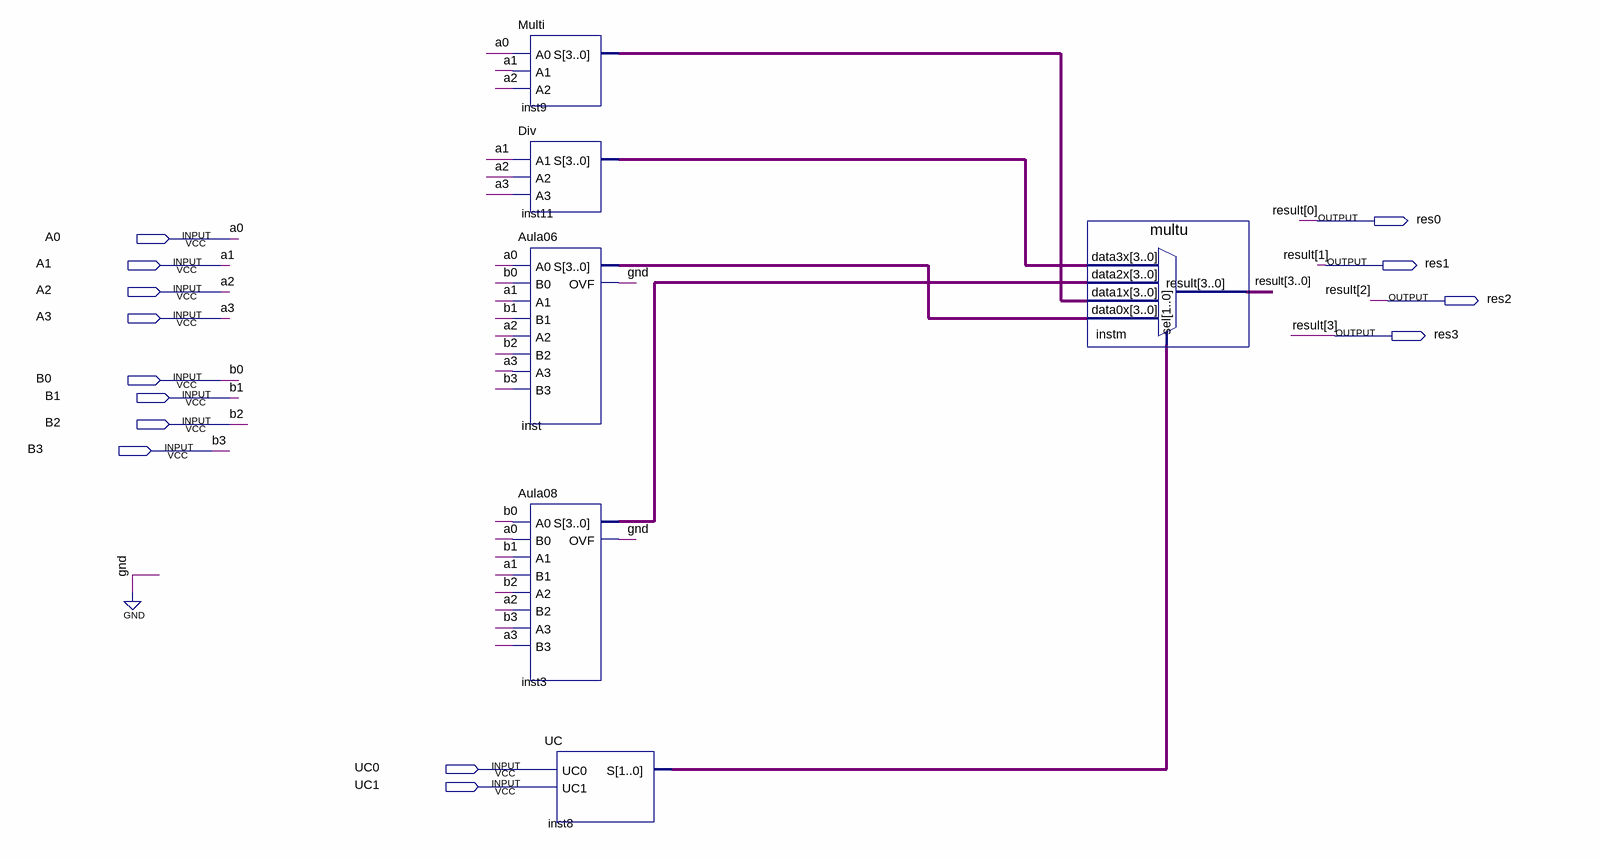
[diagram p0: schematic sheet]
// Quartus schematic ULA.bdf as structural Verilog: 6 symbols, 14 pins
module ULA (
  input  A0,
  input  A1,
  input  A2,
  input  A3,
  input  B0,
  input  B1,
  input  B2,
  input  B3,
  input  UC0,
  input  UC1,
  output res0,
  output res1,
  output res2,
  output res3
);

  wire gnd;
  wire [1:0] inst8_s;
  wire [3:0] inst3_s, inst9_s, inst11_s, inst_s;

  Multi inst9 (.A0(A0), .A1(A1), .A2(A2), .S(inst9_s));
  Div inst11 (.A1(A1), .A2(A2), .A3(A3), .S(inst11_s));
  Aula06 inst (.A0(A0), .B0(B0), .A1(A1), .B1(B1), .A2(A2), .B2(B2), .A3(A3), .B3(B3), .S(inst_s), .OVF(gnd));
  Aula08 inst3 (.A0(B0), .B0(A0), .A1(B1), .B1(A1), .A2(B2), .B2(A2), .A3(B3), .B3(A3), .S(inst3_s), .OVF(gnd));
  UC inst8 (.UC0(UC0), .UC1(UC1), .S(inst8_s));
  multu instm (
    .data3x(inst11_s), .data2x(inst3_s), .data1x(inst9_s), .data0x(inst_s), .sel(inst8_s),
    .result({res3, res2, res1, res0}));
  // also tied to GND on the sheet: gnd

  // Other names for the same wires on the sheet: result[3:0] = {res3, res2, res1, res0}
endmodule
